# EAGLE design CC2640_interface (EAGLE 7.6.0)

## Sheet 1 of 4
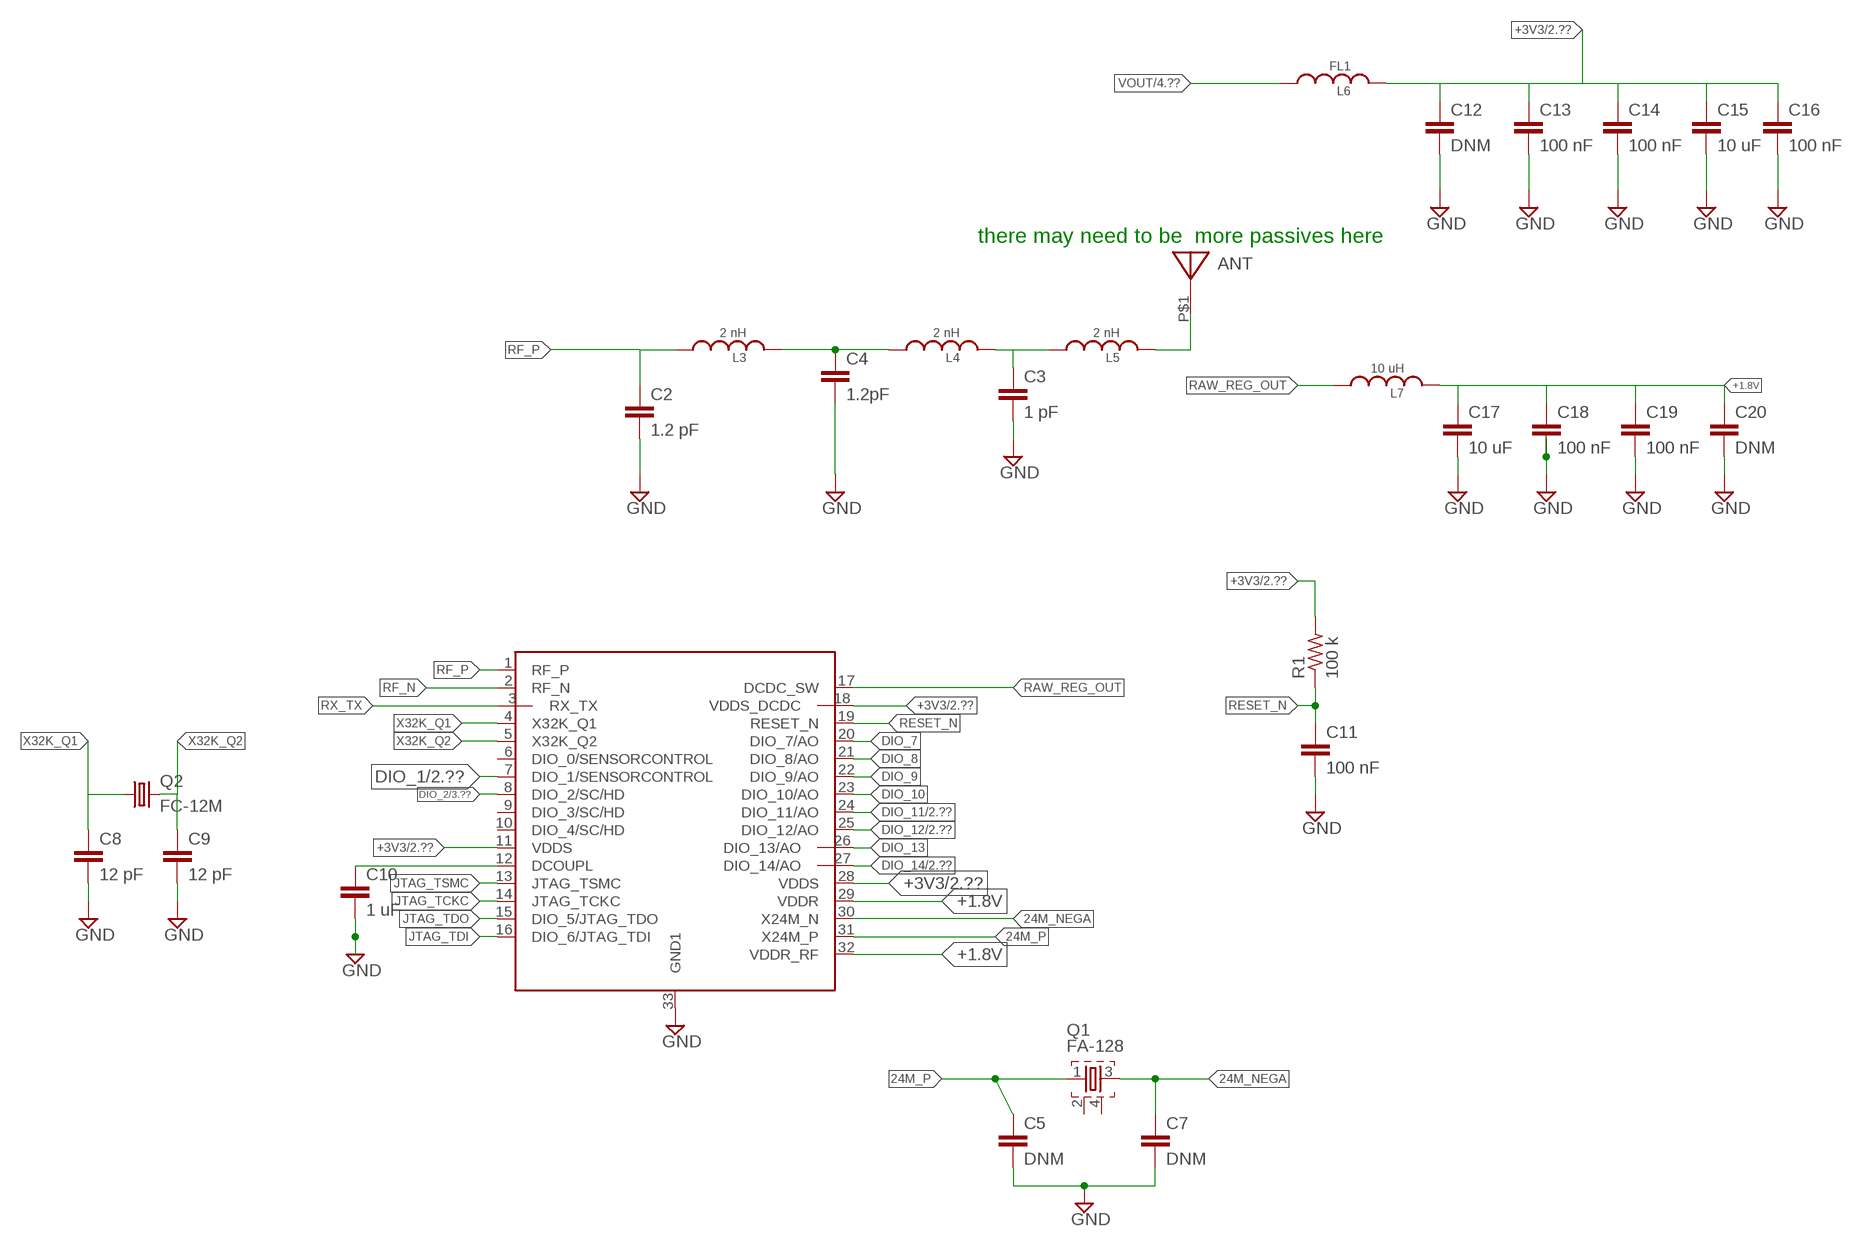
[diagram p0: schematic, sheet 1]

### Parts
ANT  2450AT18A100  [2450AT18A100]
C2  1.2 pF  C-EUC0402  [C0402]
C3  1 pF  C-EUC0402  [C0402]
C4  1.2pF  C-EUC0402  [C0402]
C5  DNM  C-EUC0402  [C0402]
C7  DNM  C-EUC0402  [C0402]
C8  12 pF  C-EUC0402  [C0402]
C9  12 pF  C-EUC0402  [C0402]
C10  1 uF  C-EUC0402  [C0402]
C11  100 nF  C-EUC0402  [C0402]
C12  DNM  C-EUC0402  [C0402]
C13  100 nF  C-EUC0402  [C0402]
C14  100 nF  C-EUC0402  [C0402]
C15  10 uF  C-EUC0402  [C0402]
C16  100 nF  C-EUC0402  [C0402]
C17  10 uF  C-EUC0402  [C0402]
C18  100 nF  C-EUC0402  [C0402]
C19  100 nF  C-EUC0402  [C0402]
C20  DNM  C-EUC0402  [C0402]
L3  2 nH  INDUCTOR0603  [0603_CAP]
L4  2 nH  INDUCTOR0603  [0603_CAP]
L5  2 nH  INDUCTOR0603  [0603_CAP]
L6  FL1  INDUCTOR0603  [0603_CAP]
L7  10 uH  INDUCTOR0603  [0603_CAP]
Q1  FA-128  [FA-128]
Q2  FC-12M  [FC-12M]
R1  100 k  R-US_R0402  [R0402@1]
U$1  CC2640-5MM  [S-PVQFN-N32]

### Nets
24M_NEGA: C7.1 Q1.3 U$1.30(X24M_N)
24M_P: C5.1 Q1.1 U$1.31(X24M_P)
+1.8V: C17.1 C18.1 C19.1 C20.1 L7.2 U$1.29(VDDR) U$1.32(VDDR_RF)
+3V3: C12.1 C13.1 C14.1 C15.1 C16.1 L6.2 R1.2 U$1.11(VDDS) U$1.18(VDDS_DCDC) U$1.28(VDDS) ; also sheet 2,3
DCOUPLE_ME: C10.1 U$1.12(DCOUPL)
DIO_1: U$1.7(DIO_1/SENSORCONTROL) ; also sheet 2
DIO_2: U$1.8(DIO_2/SC/HD) ; also sheet 3
DIO_7: U$1.20(DIO_7/AO)
DIO_8: U$1.21(DIO_8/AO)
DIO_9: U$1.22(DIO_9/AO)
DIO_10: U$1.23(DIO_10/AO)
DIO_11: U$1.24(DIO_11/AO) ; also sheet 2,3
DIO_12: U$1.25(DIO_12/AO) ; also sheet 2,3
DIO_13: U$1.26(DIO_13/AO)
DIO_14: U$1.27(DIO_14/AO) ; also sheet 2,3
GND: C2.2 C3.2 C4.2 C5.2 C7.2 C8.2 C9.2 C10.2 C11.2 C12.2 C13.2 C14.2 C15.2 C16.2 C17.2 C18.2 C19.2 C20.2 U$1.33(GND1) ; also sheet 2,3,4
JTAG_TCKC: U$1.14(JTAG_TCKC)
JTAG_TDI: U$1.16(DIO_6/JTAG_TDI)
JTAG_TDO: U$1.15(DIO_5/JTAG_TDO)
JTAG_TSMC: U$1.13(JTAG_TSMC)
N$4: C4.1 L3.2 L4.1
N$5: C3.1 L4.2 L5.1
N$7: ANT.P$1 L5.2
RAW_REG_OUT: L7.1 U$1.17(DCDC_SW)
RESET_N: C11.1 R1.1 U$1.19(RESET_N)
RF_N: U$1.2(RF_N)
RF_P: C2.1 L3.1 U$1.1(RF_P)
RX_TX: U$1.3(RX_TX)
VOUT: L6.1 ; also sheet 4
X32K_Q1: C8.1 Q2.1 U$1.4(X32K_Q1)
X32K_Q2: C9.1 Q2.2 U$1.5(X32K_Q2)
Unconnected: Q1.2 Q1.4 U$1.6(DIO_0/SENSORCONTROL) U$1.9(DIO_3/SC/HD) U$1.10(DIO_4/SC/HD)

### Notes on the sheet
- there may need to be  more passives here

## Sheet 2 of 4
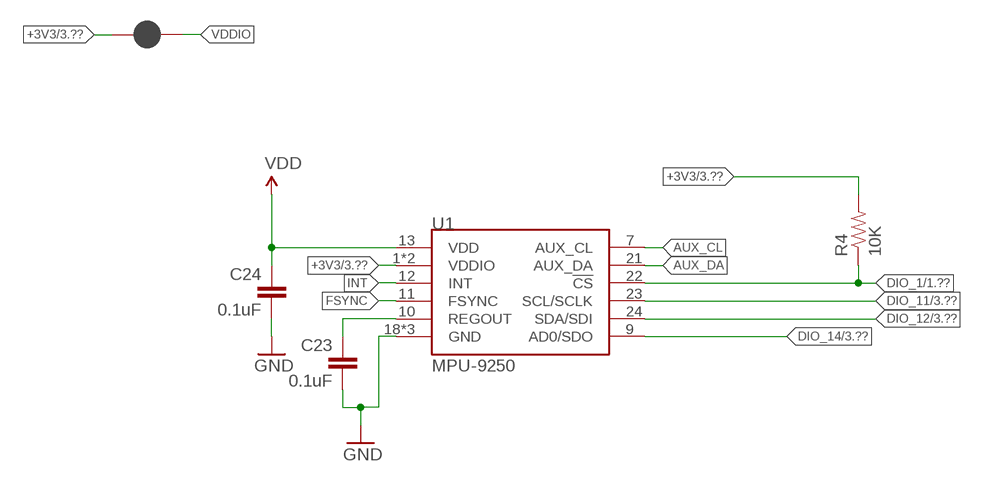
[diagram p1: schematic, sheet 2]

### Parts
C23  0.1uF  0.1UF-25V(+80/-20%)(0603)  [0603-CAP]
C24  0.1uF  0.1UF-25V(+80/-20%)(0603)  [0603-CAP]
R4  10K  10KOHM-1/10W-1%(0603)0603  [0603-RES]
SJ1  JUMPER-PAD-2-NC_BY_PASTEFULL-BOX-SILK  [PAD-JUMPER-2-NC_BY_PASTE_YES_SILK_FULL_BOX]
U1  MPU-9250  [QFN24_PAD]

### Nets
+3V3: C24.1 R4.2 SJ1.1 U1.1(VDDIO) U1.8(VDDIO) U1.13(VDD) ; supply symbol labelled VDD ; also sheet 1,3
ADSD_STUB: U1.9(AD0/SDO)
AUX_CL: U1.7(AUX_CL)
AUX_DA: U1.21(AUX_DA)
DIO_1: R4.1 U1.22(!CS) ; also sheet 1
DIO_11: U1.23(SCL/SCLK) ; also sheet 1,3
DIO_12: U1.24(SDA/SDI) ; also sheet 1,3
FSYNC: U1.11(FSYNC)
GND: C23.2 C24.2 U1.18(GND) U1.20(GND) U1.CENTER(GND) ; also sheet 1,3,4
INT: U1.12(INT)
REGOUT: C23.1 U1.10(REGOUT)
VDDIO: SJ1.2

## Sheet 3 of 4
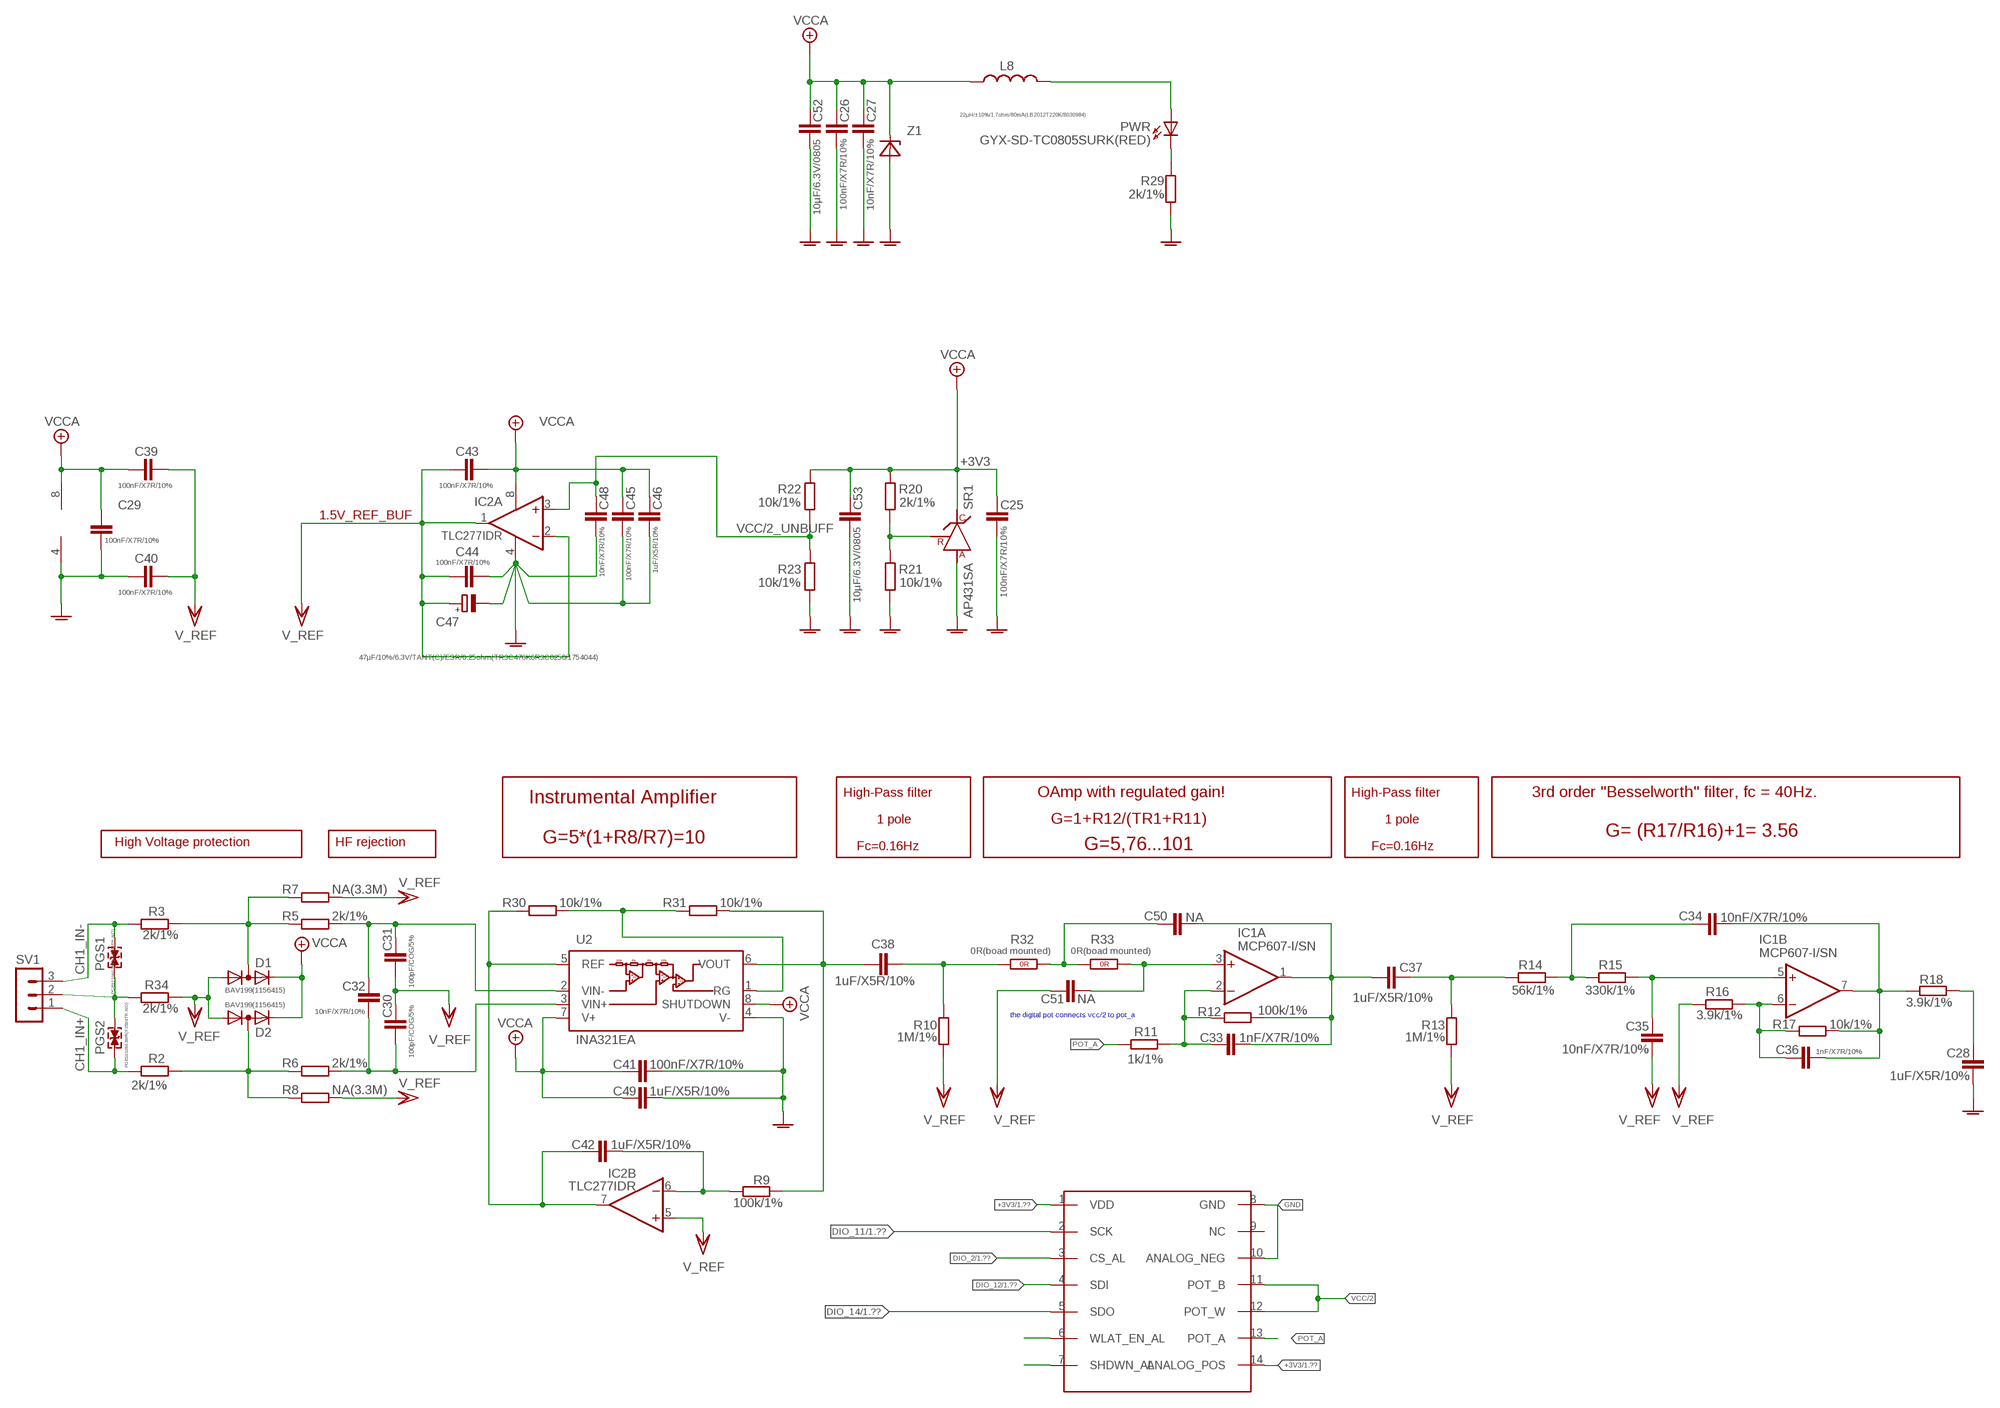
[diagram p2: schematic, sheet 3]

### Parts
C25  100nF/X7R/10%  C-EUC0603_DWS  [C0603_DWS]
C26  100nF/X7R/10%  C-EUC0603_DWS  [C0603_DWS]
C27  10nF/X7R/10%  C-EUC0603_DWS  [C0603_DWS]
C28  1uF/X5R/10%  C-EUC0603_DWS  [C0603_DWS]
C29  100nF/X7R/10%  C-EUC0603_DWS  [C0603_DWS]
C30  100pF/COG/5%  C-EUC0603_DWS  [C0603_DWS]
C31  100pF/COG/5%  C-EUC0603_DWS  [C0603_DWS]
C32  10nF/X7R/10%  C-EUC0603_DWS  [C0603_DWS]
C33  1nF/X7R/10%  C-EUC0603_DWS  [C0603_DWS]
C34  10nF/X7R/10%  C-EUC0603_DWS  [C0603_DWS]
C35  10nF/X7R/10%  C-EUC0603_DWS  [C0603_DWS]
C36  1nF/X7R/10%  C-EUC0603_DWS  [C0603_DWS]
C37  1uF/X5R/10%  C-EUC0603_DWS  [C0603_DWS]
C38  1uF/X5R/10%  C-EUC0603_DWS  [C0603_DWS]
C39  100nF/X7R/10%  C-EUC0603_DWS  [C0603_DWS]
C40  100nF/X7R/10%  C-EUC0603_DWS  [C0603_DWS]
C41  100nF/X7R/10%  C-EUC0603_DWS  [C0603_DWS]
C42  1uF/X5R/10%  C-EUC0603_DWS  [C0603_DWS]
C43  100nF/X7R/10%  C-EUC0603_DWS  [C0603_DWS]
C44  100nF/X7R/10%  C-EUC0603_DWS  [C0603_DWS]
C45  100nF/X7R/10%  C-EUC0603_DWS  [C0603_DWS]
C46  1uF/X5R/10%  C-EUC0603_DWS  [C0603_DWS]
C47  47µF/10%/6.3V/TANT(C)/ESR/0.25ohm(TR3C476K6R3C0250/1754044)  CPOL-EUCT6032  [CT6032]
C48  10nF/X7R/10%  C-EUC0603_DWS  [C0603_DWS]
C49  1uF/X5R/10%  C-EUC0603_DWS  [C0603_DWS]
C50  NA  C-EUC0603_DWS_NA  [C0603_DWS_NA]
C51  NA  C-EUC0603_DWS_NA  [C0603_DWS_NA]
C52  10µF/6.3V/0805  C-EUC0805_5MIL_DWS  [C0805_5MIL_DWS]
C53  10µF/6.3V/0805  C-EUC0805_5MIL_DWS  [C0805_5MIL_DWS]
D1  BAV199(1156415)  DIODE_AC-AC_  [SOT23C(BAT54S)]
D2  BAV199(1156415)  DIODE_AC-AC_  [SOT23C(BAT54S)]
DIG_POT  MCP41HVX1  [TSSOP-14/5MM]
IC1  MCP607-I/SN  LM358D  [SO08]
IC2  TLC277IDR  LM358D  [SO08]
L8  22µH/±10%/1.7ohm/80mA(LB2012T220K/8030984)  L-USL0805_5MIL_DWS  [L0805_5MIL_DWS]
PGS1  PGB1010603MR(F2594TR-ND)  [0603]
PGS2  PGB1010603MR(F2594TR-ND)  [0603]
PWR  GYX-SD-TC0805SURK(RED)  LED0805DWS  [LED-0805]
R2  2k/1%  R-EU_R0603_5MIL_DWS  [R0603_5MIL_DWS]
R3  2k/1%  R-EU_R0603_5MIL_DWS  [R0603_5MIL_DWS]
R5  2k/1%  R-EU_R0603_5MIL_DWS  [R0603_5MIL_DWS]
R6  2k/1%  R-EU_R0603_5MIL_DWS  [R0603_5MIL_DWS]
R7  NA(3.3M)  R-EU_R0603_5MIL_DWS_NA  [R0603_5MIL_DWS_NA]
R8  NA(3.3M)  R-EU_R0603_5MIL_DWS_NA  [R0603_5MIL_DWS_NA]
R9  100k/1%  R-EU_R0603_5MIL_DWS  [R0603_5MIL_DWS]
R10  1M/1%  R-EU_R0603_5MIL_DWS  [R0603_5MIL_DWS]
R11  1k/1%  R-EU_R0603_5MIL_DWS  [R0603_5MIL_DWS]
R12  100k/1%  R-EU_R0603_5MIL_DWS  [R0603_5MIL_DWS]
R13  1M/1%  R-EU_R0603_5MIL_DWS  [R0603_5MIL_DWS]
R14  56k/1%  R-EU_R0603_5MIL_DWS  [R0603_5MIL_DWS]
R15  330k/1%  R-EU_R0603_5MIL_DWS  [R0603_5MIL_DWS]
R16  3.9k/1%  R-EU_R0603_5MIL_DWS  [R0603_5MIL_DWS]
R17  10k/1%  R-EU_R0603_5MIL_DWS  [R0603_5MIL_DWS]
R18  3.9k/1%  R-EU_R0603_5MIL_DWS  [R0603_5MIL_DWS]
R20  2k/1%  R-EU_R0603_5MIL_DWS  [R0603_5MIL_DWS]
R21  10k/1%  R-EU_R0603_5MIL_DWS  [R0603_5MIL_DWS]
R22  10k/1%  R-EU_R0603_5MIL_DWS  [R0603_5MIL_DWS]
R23  10k/1%  R-EU_R0603_5MIL_DWS  [R0603_5MIL_DWS]
R29  2k/1%  R-EU_R0603_5MIL_DWS  [R0603_5MIL_DWS]
R30  10k/1%  R-EU_R0603_5MIL_DWS  [R0603_5MIL_DWS]
R31  10k/1%  R-EU_R0603_5MIL_DWS  [R0603_5MIL_DWS]
R32  0R(boad mounted)  R_0R0R(NA)  [0603_0R]
R33  0R(boad mounted)  R_0R0R(NA)  [0603_0R]
R34  2k/1%  R-EU_R0603_5MIL_DWS  [R0603_5MIL_DWS]
SR1  AP431SA  TL431'''  [SOT-23]
SV1  MA03-1  [MA03-1]
U2  INA321EA  [MSOP8]
Z1  BZV55C6V2  ZDIOD-SMD  [MINI-MELF]

### Nets
+3V3: C25.1 C26.1 C27.1 C29.1 C39.1 C41.1 C43.2 C45.1 C46.1 C49.1 C52.1 C53.1 D1.2(K) D2.2(K) DIG_POT.1(VDD) DIG_POT.14(ANALOG_POS) IC1.8(P:V+) IC2.8(P:V+) L8.2 R20.2 R22.2 SR1.1(C) U2.7(V+) U2.8(SHUTDOWN) Z1.1(C) ; supply symbol labelled VCCA ; also sheet 1,2
ADC0: C28.1 R18.1
CH1_IN+: PGS2.1 R2.1 SV1.1
CH1_IN-: PGS1.2 R3.1 SV1.3
DIO_2: DIG_POT.3(CS_AL) ; also sheet 1
DIO_11: DIG_POT.2(SCK) ; also sheet 1,2
DIO_12: DIG_POT.4(SDI) ; also sheet 1,2
DIO_14: DIG_POT.5(SDO) ; also sheet 1,2
GND: DIG_POT.8(GND) DIG_POT.10(ANALOG_NEG) ; also sheet 1,2,4
GNDA [pwr]: C25.2 C26.2 C27.2 C28.2 C29.2 C40.1 C41.2 C44.2 C45.2 C46.2 C47.- C48.2 C49.2 C52.2 C53.2 IC1.4(P:V-) IC2.4(P:V-) R21.1 R23.1 R29.1 SR1.3(A) U2.4(V-) Z1.2(A)
N$1: D1.3(AK) R3.2 R5.2 R7.2
N$6: DIG_POT.6(WLAT_EN_AL)
N$8: D2.3(AK) R2.2 R6.2 R8.2
N$9: C42.2 IC2.7(B:OUT) R30.2 U2.5(REF)
N$10: R30.1 R31.2 U2.1(RG)
N$11: L8.1 PWR.A
N$12: DIG_POT.7(SHDWN_AL)
N$15: PWR.C R29.2
N$22: R20.1 R21.2 SR1.2(R)
N$37: C38.2 R10.1 R32.1(1.1)
N$38: C50.1 R32.2(1.2) R33.1(1.1)
N$39: PGS1.1 PGS2.2 R34.1 SV1.2
N$81: C37.2 R13.1 R14.1
N$83: C38.1 R9.2 R31.1 U2.6(VOUT)
N$92: C30.1 C32.1 R6.1 U2.3(VIN+)
N$93: C31.2 C32.2 R5.1 U2.2(VIN-)
N$102: C51.1 IC1.3(A:+IN) R33.2(1.2)
N$104: C33.2 C37.1 C50.2 IC1.1(A:OUT) R12.2
N$105: C33.1 IC1.2(A:-IN) R11.1 R12.1
N$107: C35.1 IC1.5(B:+IN) R15.2
N$108: C34.1 R14.2 R15.1
N$109: C34.2 C36.2 IC1.7(B:OUT) R17.2 R18.2
N$110: C36.1 IC1.6(B:-IN) R16.1 R17.1
N$145: C42.1 IC2.6(B:-IN) R9.1
POT_A: DIG_POT.13(POT_A) R11.2
VCC/2: C30.2 C31.1 C35.2 C39.2 C40.2 C43.1 C44.1 C47.+ C51.2 D1.1(A) D2.1(A) DIG_POT.11(POT_B) DIG_POT.12(POT_W) IC2.1(A:OUT) IC2.2(A:-IN) IC2.5(B:+IN) R7.1 R8.1 R10.2 R13.2 R16.2 R34.2 ; supply symbol labelled V_REF
VCC/2_UNBUFF: C48.1 IC2.3(A:+IN) R22.1 R23.2
Unconnected: DIG_POT.9(NC)

### Notes on the sheet
- 1.5V_REF_BUF
- High-Pass filter | OAmp with regulated gain! | High-Pass filter | 3rd order "Besselworth" filter, fc = 40Hz.
- Instrumental Amplifier
- 1 pole | G=1+R12/(TR1+R11) | 1 pole
- High Voltage protection | HF rejection | G= (R17/R16)+1= 3.56
- G=5*(1+R8/R7)=10
- Fc=0.16Hz | G=5,76...101 | Fc=0.16Hz
- the digital pot connects vcc/2 to pot_a

## Sheet 4 of 4
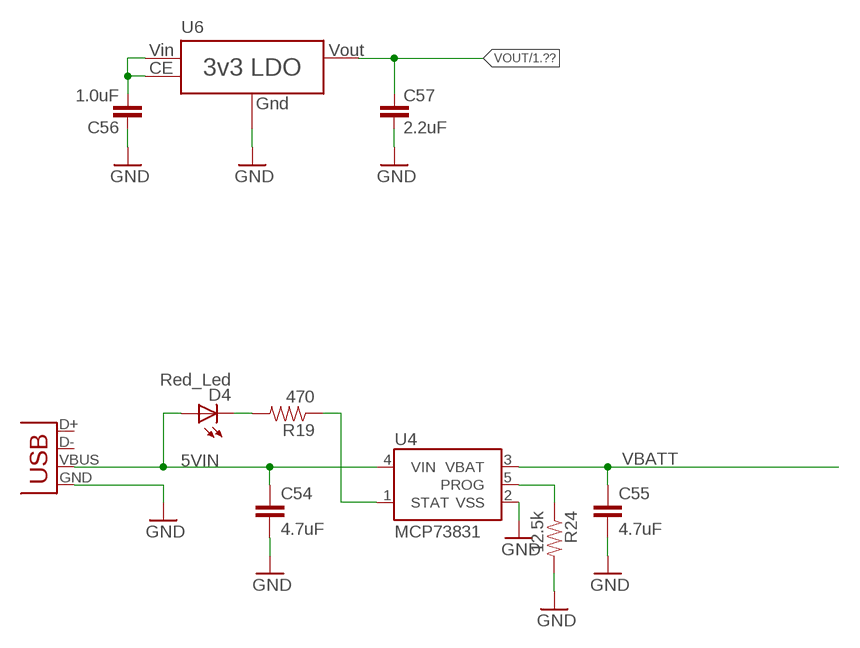
[diagram p3: schematic, sheet 4]

### Parts
C54  4.7uF  CAP0402-CAP  [0402-CAP]
C55  4.7uF  CAP0402-CAP  [0402-CAP]
C56  1.0uF  C-EUC0805  [C0805]
C57  2.2uF  C-EUC0805  [C0805]
D4  Red_Led  LED0603  [LED-0603]
R19  470  RESISTOR0402-RES  [0402-RES]
R24  12.5k  RESISTOR0402-RES  [0402-RES]
U4  MCP73831  [SOT23-5]
U6  XC6210  [SOT-25]
X1  USB-MICROB  [USB-MICROB]

### Nets
5VIN: C54.1 D4.A U4.4(VIN) X1.VBUS
GND: C54.2 C55.2 C56.1 C57.2 R24.2 U4.2(VSS) U6.2(GND) X1.GND ; also sheet 1,2,3
N$2: R24.1 U4.5(PROG)
N$3: D4.C R19.2
N$14: R19.1 U4.1(STAT)
VBATT: C55.1 C56.2 U4.3(VBAT) U6.1(VIN) U6.3(CE)
VOUT: C57.1 U6.5(VOUT) ; also sheet 1
Unconnected: X1.D+ X1.D-

## Library data of the parts
ANT = Johanson_antenna:2450AT18A100
C2-C5 C7-C20 C25-C46 C48-C53 = rcl:C-EU: CAPACITOR, European symbol
C23 C24 = SparkFun-Capacitors:0.1UF-25V(+80/-20%)(0603): CAP-00810 Ceramic Standard decoupling cap; PROD_ID: CAP-00810
C47 = rcl:CPOL-EU: POLARIZED CAPACITOR, European symbol
C54 C55 = SparkFun:CAP: Capacitor Standard 0603 ceramic capacitor, and 0.1" leaded capacitor.
C56 C57 = Jon_LIB:C-EU: CAPACITOR, European symbol
D1 D2 = semicon-smd-ipc:DIODE_AC-AC_: DUAL DIODE
D4 = SparkFun:LED: LEDs Standard schematic elements and footprints for 5mm, 3mm, 1206, and 0603 sized LEDs. 5mm - Spark Fun Electronics SKU : COM-00529 (and others)
DIG_POT = chips:MCP41HVX1
IC1 IC2 = linear:LM358: OP AMP
L3-L7 = passives:INDUCTOR: A very specific inductor
L8 = rcl:L-US: INDUCTOR, American symbol
PGS1 PGS2 = OLIMEX_DISCRET:PGB1010603MR: PulseGuard® Suppressors Surface Mount Polymeric ESD Suppressors
PWR = DOUBLE-SIDE:LED
Q1 = crystal:FA-: MHz RANGE CRYSTAL UNIT Source: Epson Toyocom
Q2 = crystal:FC-12M: kHz RANGE CRYSTAL UNIT LOW PROFILE SMD Source: Epson Toyocom FC-12M.pdf
R1 = rcl:R-US_: RESISTOR, American symbol
R2 R3 R5-R18 R20-R23 R29-R31 R34 = rcl:R-EU_: RESISTOR, European symbol
R4 = SparkFun-Resistors:10KOHM-1/10W-1%(0603): RES-00824; PROD_ID: RES-00824
R19 R24 = SparkFun:RESISTOR: Resistor Basic schematic elements and footprints for 0603, 1206, and PTH resistors.
R32 R33 = OLIMEX_DISCRET:R_0R
SJ1 = SparkFun-Passives:JUMPER-PAD-2-NC_BY_PASTE
SR1 = OLIMEX_IC:TL431: TL431 Programmable Shunt Regulator Features: -> Programmable Output Voltage to 36 Volts -> Low Dynamic Output Impedance 0.20 Typical -> Sink Current Capability of 1.0 to 100mA -> Equivalent Full-Range Temperature Coefficient of 50ppm/°C Typical -> Temperature Compensated For Operation Over Full Rated Operating Temperature Range -> Low Output Noise Voltage -> Fast Turn-on Response
SV1 = con-lstb:MA03-1: PIN HEADER; OC_FARNELL: unknown; OC_NEWARK: unknown
U1 = Testing:MPU-9250: NC pin 19. 2-6 & 14-17 not internally connected. May be used for PCB trace routing.; PROD_ID: IC-13192
U2 = OLIMEX_IC:INA321
U4 = SparkFun:MCP73831: Microchip's MCP73831 Miniature single cell, fully integrated Li-Ion, Li-polymer charge management controller http://ww1.microchip.com/downloads/en/DeviceDoc/21984a.pdf
U6 = MAAV:XC6210; DIGIKEY#: 893-1075-1-ND
U$1 = chips:CC2640-5MM
X1 = SparkFun:USB: USB Connectors USB-B-PTH is fully proven SKU : PRT-00139 USB-miniB is fully proven SKU : PRT-00587 USB-A-PCB is untested. USB-A-H is throughly reviewed, but untested. Spark Fun Electronics SKU : PRT-00437 USB-B-SMT is throughly reviewed, but untested. Needs silkscreen touching up. USB-A-S has not been used/tested USB-MB-H has not been used/tested
Z1 = gogo:ZDIOD-SMD

## Net classes
1 pwr: width 0.4 mm, drill 0.6 mm, clearance 0.23 mm

## Board
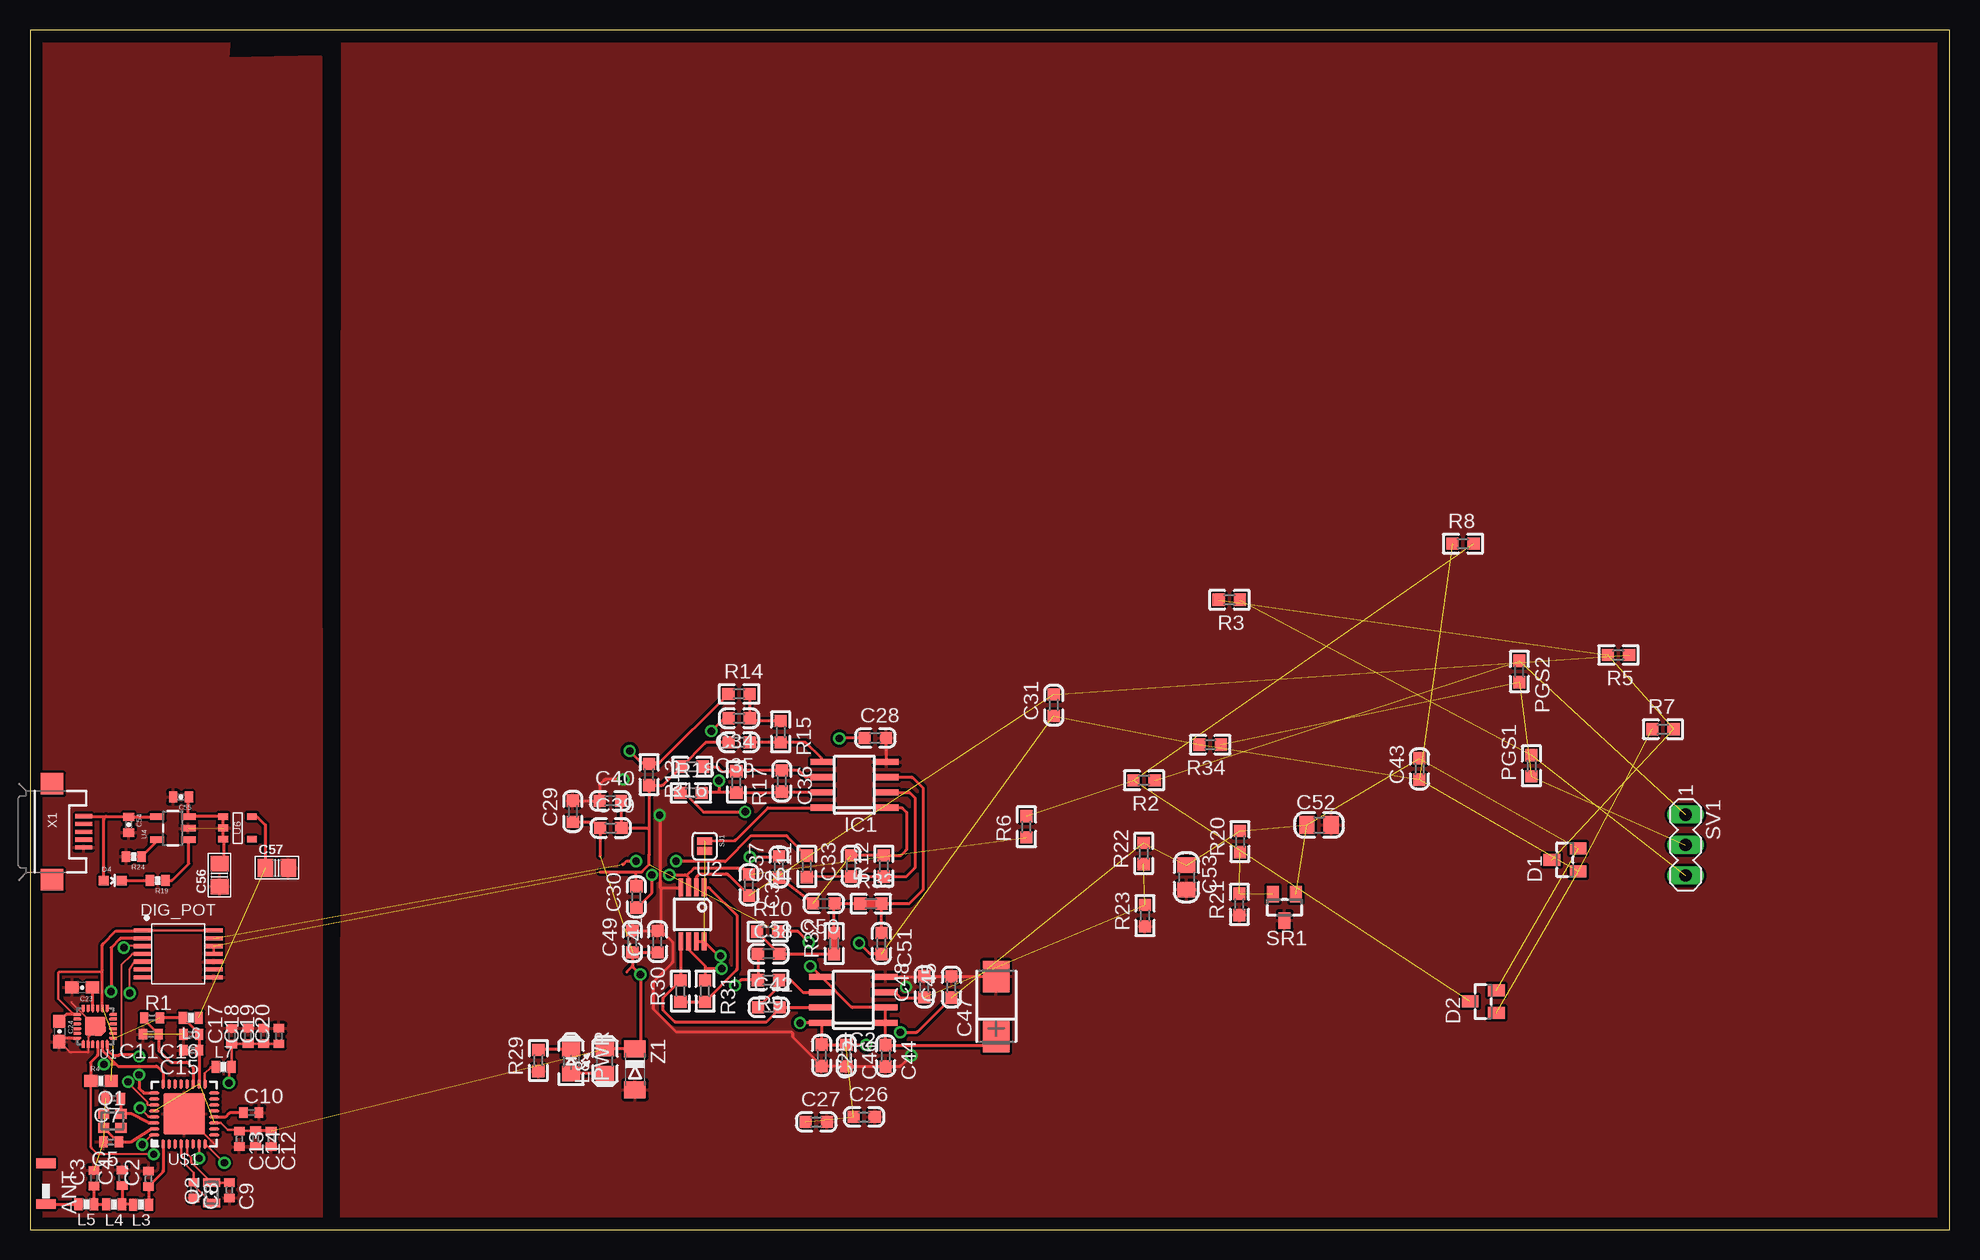
[diagram p4: board, top side]
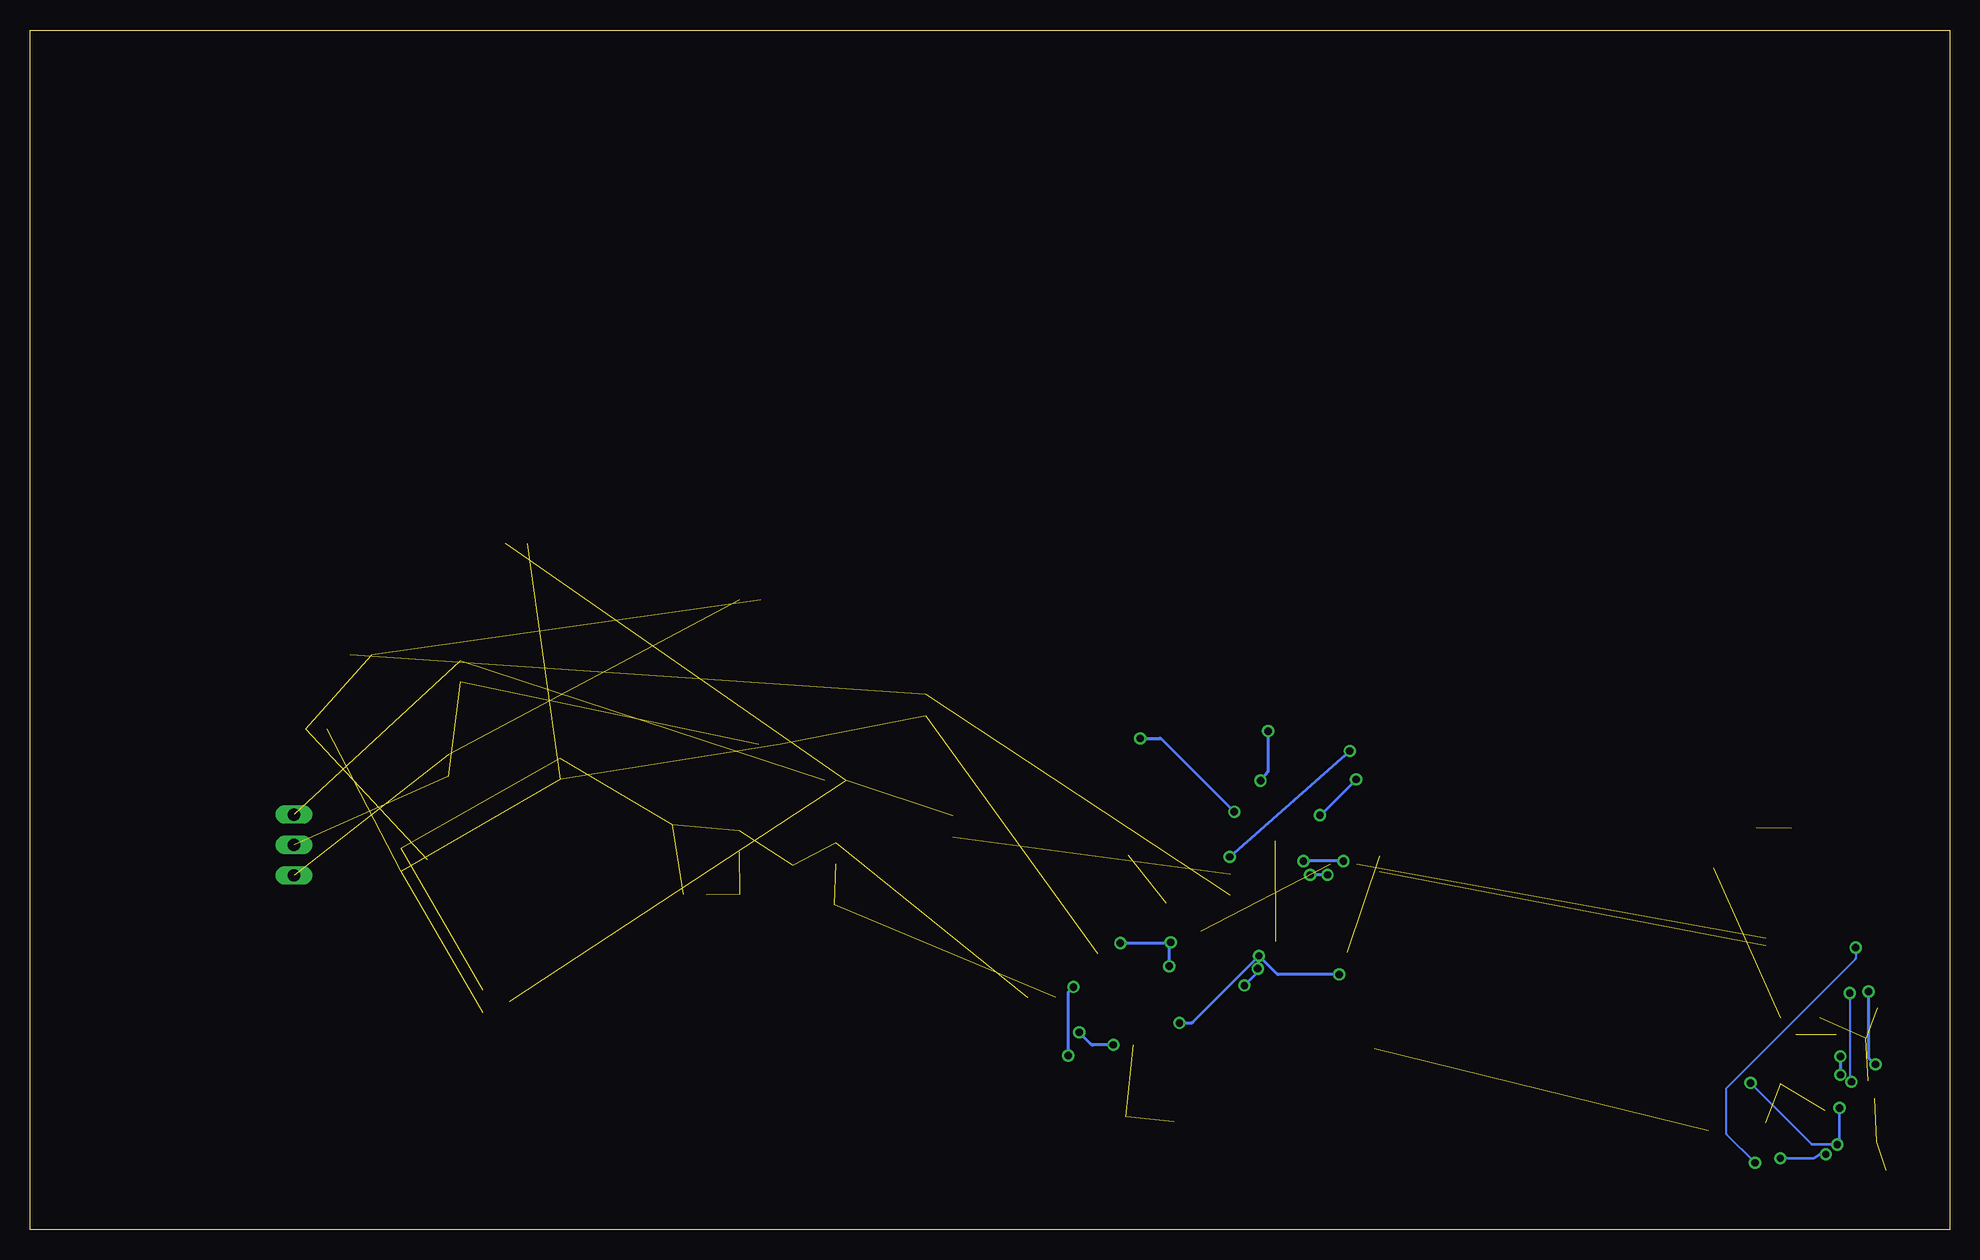
[diagram p5: board, bottom side, seen from below]

Size 160 x 100 mm. Coordinates in mm from the lower left corner, seen from the top.
Outline: 0,0 160,0 160,100 0,100 0,0
Copper layers (1*16): Top 0.035mm / dielectric 1.5mm / Bottom 0.035mm
Design rules "default": minimum track width 10mil, minimum drill 24mil, track to track 8mil, track to pad 8mil, pad to pad 8mil, via to via 8mil, smd to smd 8mil, copper to edge 40mil, drill to drill 8mil, minimum pad ring 10mil, minimum via ring 8mil, stop-mask expansion 4mil, vias tented up to drill 0mil, thermal gap 10mil

### Footprints (pad centres in the part's own frame; a part is rotated, then mirrored left to right if it is on the bottom)
2450AT18A100 = smd 0.8 x 1.6: P$1 -1.7,0; P$2 1.7,0
C0402 = smd 0.7 x 0.9: 1 -0.65,0; 2 0.65,0
0603-CAP = smd 1.1 x 1: 1 -0.85,0; 2 0.85,0
C0603_DWS = smd 1.016 x 1.016: 1 -0.889,0; 2 0.889,0
CT6032 = smd 2.6 x 2.2: + -2.5,0; - 2.5,0
C0603_DWS_NA = smd 1.016 x 1.016: 1 -0.889,0; 2 0.889,0
C0805_5MIL_DWS = smd 1.27 x 1.524: 1 -1.016,0; 2 1.016,0
0402-CAP = smd 0.7 x 0.9: 1 -0.65,0; 2 0.65,0
C0805 = smd 1.3 x 1.5: 1 -0.95,0; 2 0.95,0
SOT23C(BAT54S) = smd 1 x 1.4: 1 -0.95,-1.1; 2 0.95,-1.1; 3 0,1.1
LED-0603 = smd 0.8 x 0.8: A 0,-0.75; C 0,0.75
TSSOP-14/5MM = smd 1.5 x 0.35: 1 -2.95,1.95; 2 -2.95,1.3; 3 -2.95,0.65; 4 -2.95,0; 5 -2.95,-0.65; 6 -2.95,-1.3; 7 -2.95,-1.95; 8 2.95,-1.95; 9 2.95,-1.3; 10 2.95,-0.65; 11 2.95,0; 12 2.95,0.65; 13 2.95,1.3; 14 2.95,1.95
SO08 = smd 0.508 x 2.032: 1 -1.905,-2.667; 2 -0.635,-2.667; 3 0.635,-2.667; 4 1.905,-2.667; 5 1.905,2.667; 6 0.635,2.667; 7 -0.635,2.667; 8 -1.905,2.667
0603_CAP = smd 0.7 x 1: 1 -0.65,0; 2 0.65,0
L0805_5MIL_DWS = smd 1.27 x 1.524: 1 -1.016,0; 2 1.016,0
0603 = smd 1.016 x 1.016: 1 -0.889,0; 2 0.889,0
LED-0805 = smd 1.27 x 1.524: A 1.016,0; C -1.016,0
FA-128 = smd 0.95 x 0.85: 1 -0.725,-0.575; 2 0.725,-0.575; 3 0.725,0.575; 4 -0.725,0.575
FC-12M = smd 0.7 x 1.4: 1 -0.85,0; 2 0.85,0
R0402@1 = smd 0.7 x 0.9: 1 -0.65,0; 2 0.65,0
R0603_5MIL_DWS = smd 1.016 x 1.016: 1 -0.889,0; 2 0.889,0
0603-RES = smd 1.1 x 1: 1 -0.85,0; 2 0.85,0
R0603_5MIL_DWS_NA = smd 1.016 x 1.016: 1 -0.889,0; 2 0.889,0
0402-RES = smd 0.7 x 0.9: 1 -0.65,0; 2 0.65,0
0603_0R = smd 1.016 x 1.016: 1 -0.889,0; 2 0.889,0
PAD-JUMPER-2-NC_BY_PASTE_YES_SILK_FULL_BOX = smd 0.635 x 1.27: 1 -0.412,0; 2 0.412,0
SOT-23 = smd 1 x 1.4: 1 -0.95,-1.1; 2 0.95,-1.1; 3 0,1.1
MA03-1 = drill 1.016 long: 1 -2.54,0; 2 0,0; 3 2.54,0
QFN24_PAD = smd 0.5 x 0.25: 1 -1.55,1; 2 -1.55,0.6; 3 -1.55,0.2; 4 -1.55,-0.2; 5 -1.55,-0.6; 6 -1.55,-1; 13 1.55,-1; 14 1.55,-0.6; 15 1.55,-0.2; 16 1.55,0.2; 17 1.55,0.6; 18 1.55,1 | smd 0.08 x 0.13: 1$1 -1.32,1.06; 1$3 -1.26,0.94; P$33 1.26,-0.94; P$34 1.32,-1.06; P$58 1.26,0.94; P$59 1.32,1.06; P$68 -1.26,-0.94; P$69 -1.32,-1.06 | smd 0.1 x 0.185 rotated 45: 1$2 -1.25,1.024; P$49 1.024,-1.25 | smd 0.14 x 0.14: 1$4 -1.22,0.945; P$23 -0.945,-1.22; P$24 1.22,-0.945; P$36 0.945,1.22; P$51 0.945,-1.22; P$56 1.22,0.945; P$61 -0.945,1.22; P$66 -1.22,-0.945 | smd 0.05 x 0.05: 1$5 -1.175,0.97; P$25 -0.97,-1.175; P$31 1.175,-0.97; P$37 0.97,1.175; P$52 0.97,-1.175; P$57 1.175,0.97; P$62 -0.97,1.175; P$67 -1.175,-0.97 | smd 0.25 x 0.5: 7 -1,-1.55; 8 -0.6,-1.55; 9 -0.2,-1.55; 10 0.2,-1.55; 11 0.6,-1.55; 12 1,-1.55; 19 1,1.55; 20 0.6,1.55; 21 0.2,1.55; 22 -0.2,1.55; 23 -0.6,1.55; 24 -1,1.55 | smd 0.25 x 0.25: CENTER 0,0 | smd 0.4 x 0.4: DBBADFE -0.675,0.24 | smd 0.6 x 1.2: DBBADFE1 -0.575,-0.195 | smd 0.25 x 0.3: P$1 -0.2,1.3; P$3 0.2,1.3; P$5 0.6,1.3; P$11 -0.6,1.3; P$16 0.2,-1.3; P$18 -0.2,-1.3; P$20 -0.6,-1.3; P$26 0.6,-1.3 | smd 0.3 x 0.25: P$2 -1.3,0.2; P$4 -1.3,0.6; P$28 -1.3,-0.2; P$38 -1.3,-0.6; P$40 1.3,0.2; P$42 1.3,-0.2; P$44 1.3,-0.6; P$50 1.3,0.6 | smd 0.1 x 0.185 rotated 225: P$7 1.25,-1.024; P$60 -1.024,1.25 | smd 1.1 x 1.59: P$13 0.325,0 | smd 0.3 x 0.5 rotated 315: P$14 -0.592,0.512 | smd 0.5 x 1.59: P$15 -0.27,0 | smd 0.1 x 0.185 rotated 135: P$22 -1.024,-1.25; P$55 1.25,1.024 | smd 0.13 x 0.08: P$27 -0.94,-1.26; P$29 -1.06,-1.32; P$39 0.94,1.26; P$41 1.06,1.32; P$53 0.94,-1.26; P$54 1.06,-1.32; P$63 -0.94,1.26; P$64 -1.06,1.32 | smd 0.1 x 0.185 rotated 315: P$35 1.024,1.25; P$65 -1.25,-1.024
MSOP8 = smd 0.4 x 1.5: 1 -0.975,-2.25; 2 -0.325,-2.25; 3 0.325,-2.25; 4 0.975,-2.25; 5 0.975,2.25; 6 0.325,2.25; 7 -0.325,2.25; 8 -0.975,2.25
SOT23-5 = smd 0.55 x 1.2: 1 -0.95,-1.3; 2 0,-1.3; 3 0.95,-1.3; 4 0.95,1.3; 5 -0.95,1.3
SOT-25 = smd 0.55 x 0.8: 1 -0.95,-1.2; 2 0,-1.2; 3 0.95,-1.2; 4 0.95,1.2; 5 -0.95,1.2
S-PVQFN-N32 = smd 0.26 x 0.85: 1 -0.48,-2.5; 2 0.02,-2.5; 3 0.52,-2.5; 4 1.02,-2.5; 5 1.52,-2.5; 6 2.02,-2.5; 7 2.52,-2.5; 8 3.02,-2.5; 17 3.02,2.5; 18 2.52,2.5; 19 2.02,2.5; 20 1.52,2.5; 21 1.02,2.5; 22 0.52,2.5; 23 0.02,2.5; 24 -0.48,2.5 | smd 0.85 x 0.26: 9 3.77,-1.75; 10 3.77,-1.25; 11 3.77,-0.75; 12 3.77,-0.25; 13 3.77,0.25; 14 3.77,0.75; 15 3.77,1.25; 16 3.77,1.75; 25 -1.23,1.75; 26 -1.23,1.25; 27 -1.23,0.75; 28 -1.23,0.25; 29 -1.23,-0.25; 30 -1.23,-0.75; 31 -1.23,-1.25; 32 -1.23,-1.75 | smd 3.45 x 3.45: 33 1.27,0
USB-MICROB = smd 0.35 x 1.4: D+ 0,2.65; D- -0.65,2.65; GND 1.3,2.65; ID 0.65,2.65; VBUS -1.3,2.65 | smd 1.8 x 1.9: MT1 -4,0; MT2 4,0
MINI-MELF = smd 1.4 x 1.8: 1 -1.7,0; 2 1.7,0

### Placement (x,y rotation side)
ANT  1.33,3.82 90 top
C2  9.88,4.24 90 top
C3  5.33,4.28 90 top
C4  7.68,4.32 90 top
C5  6.76,7.3 180 top
C7  6.94,10.94 180 top
C8  13.66,3.29 270 top
C9  16.63,3.28 270 top
C10  18.45,9.75 0 top
C11  10.08,16.28 180 top
C12  20.11,7.56 270 top
C13  17.45,7.56 270 top
C14  18.81,7.59 270 top
C15  13.45,14.95 180 top
C16  13.45,16.27 180 top
C17  16.82,16.11 90 top
C18  18.18,16.13 90 top
C19  19.49,16.14 90 top
C20  20.75,16.13 90 top
C23  4.35,20.17 180 top
C24  2.45,16.51 270 top
C25  65.99,14.52 270 top
C26  69.53,9.39 0 top
C27  65.54,8.97 0 top
C28  70.46,40.98 0 top
C29  45.24,34.86 90 top
C30  50.54,27.73 90 top
C31  85.33,43.71 90 top
C32  59.93,28.73 270 top
C33  68.44,30.3 90 top
C34  59.11,42.62 180 top
C35  59.11,40.61 180 top
C36  62.66,37.39 270 top
C37  62.43,30.23 90 top
C38  61.56,22.98 0 top
C39  48.4,33.47 0 top
C40  48.38,35.73 0 top
C41  52.31,24 90 top
C42  61.58,18.53 0 top
C43  115.82,38.4 90 top
C44  71.32,14.48 270 top
C45  76.81,20.22 90 top
C46  68.04,14.5 270 top
C47  80.53,18.59 90 top
C48  74.54,20.23 90 top
C49  50.21,24 90 top
C50  66.17,27.18 180 top
C51  70.97,23.85 270 top
C52  107.45,33.73 0 top
C53  96.39,29.36 270 top
C54  8.23,33.75 270 top
C55  12.59,36.05 180 top
C56  15.8,29.54 90 top
C57  20.58,30.15 0 top
D1  127.95,30.82 90 top
D2  121.14,19 90 top
D4  6.9,29.1 270 top
DIG_POT  12.34,22.98 0 top
IC1  68.73,37.08 90 top
IC2  68.64,19.14 90 top
L3  9.25,2.08 180 top
L4  7,2.08 180 top
L5  4.69,2.12 180 top
L6  13.41,17.66 180 top
L7  16.14,13.55 0 top
L8  47.92,14.04 90 top
PGS1  125.16,38.66 90 top
PGS2  124.14,46.52 270 top
PWR  45.1,14.01 270 top
Q1  6.87,9.06 0 top
Q2  15.14,3.06 90 top
R1  10.17,17.65 0 top
R2  92.86,37.45 180 top
R3  99.98,52.5 180 top
R4  5.93,12.41 0 top
R5  132.41,47.89 180 top
R6  83.05,33.57 90 top
R7  136.12,41.71 0 top
R8  119.45,57.18 0 top
R9  61.55,20.8 180 top
R10  61.49,24.84 0 top
R11  64.74,30.27 90 top
R12  71.17,30.3 90 top
R13  51.6,37.93 270 top
R14  59.1,44.65 0 top
R15  62.57,41.49 270 top
R16  55.19,38.58 180 top
R17  58.88,37.31 270 top
R18  55.09,36.4 0 top
R19  10.65,29.1 180 top
R20  100.86,32.35 90 top
R21  100.81,27.11 90 top
R22  92.83,31.35 90 top
R23  92.94,26.16 90 top
R24  8.66,31.09 180 top
R29  42.38,14.09 90 top
R30  54.21,19.87 90 top
R31  56.27,19.88 270 top
R32  67.03,23.84 90 top
R33  70.09,27.17 0 top
R34  98.38,40.42 180 top
SJ1  56.23,31.97 270 top
SR1  104.57,26.86 180 top
SV1  138,32.05 270 top
U1  5.44,16.95 180 top
U2  55.22,26.27 180 top
U4  11.91,33.46 90 top
U6  17.3,33.48 270 top
U$1  11.58,9.63 0 top
X1  1.84,33.16 270 top
Z1  50.43,13.35 270 top

### Tracks (layer width: path | path; a pad name or v marks a point on that pad's centre or on a via)
5VIN
  Top 0.254: X1.VBUS 6.33,34.46 | 6.33,34.46 8.08,34.46 arc-45 C54.1 10.58,34.4 arc45 U4.4 | D4.A 6.15,34.18 arc-45 6.22,34.36 6.33,34.46
24M_NEGA
  Top 0.254: U$1.30 9.95,8.88 arc-45 9.81,8.94 8.43,9.65 7.63,9.65 arc45 Q1.3 7.59,10.93 arc45 C7.1
24M_P
  Top 0.254: U$1.31 10.16,8.38 arc45 10.02,8.32 8.38,7.29 7.43,7.29 arc-45 C5.1 arc-45 7.28,7.36 Q1.1
+1.8V  (via drill 0.61)
  Top 0.203: C20.1 19.51,15.48 arc-45 C19.1 18.2,15.49 arc45 C18.1 16.87,15.48 arc45 C17.1 16.82,13.62 arc-45 L7.2 16.65,13.41 arc45 16.59,13.26 v16.59,12.22 | U$1.32 10.22,7.88 arc45 10.08,7.82 v9.35,7.09 | U$1.29 10.01,9.38 arc-45 9.87,9.44 v9.17,10.13
  Bottom 0.203: v16.59,12.22 11.52,7.15 arc-45 11.37,7.09 v9.35,7.09 9.23,7.21 arc-45 9.17,7.35 v9.17,10.13
+3V3  (via drill 0.61)  (18 unrouted)
  Top 0.152: U1.13 3.97,17.95 arc45 3.99,17.96
  Top 0.203: U$1.11 15.89,8.88 16.46,8.31 17.36,8.31 C13.1 18.79,8.21 C14.1 | 14.1,12.14 arc45 U$1.18 | 3.99,17.96 3.69,17.96 arc-45 3.55,18.02 2.34,19.23 2.34,21.28 arc-45 2.4,21.42 2.44,21.46 5.8,21.46 arc45 5.94,21.52 6.04,21.61 | DIG_POT.1 DIG_POT.14
  Top 0.254: U$1.18 C15.1 C16.1 arc-45 14.08,16.28 arc45 14.04,16.37 L6.2 10.84,17.66 arc45 R1.2 | C12.1 18.87,8.21 arc-45 C14.1 | 47.51,31.14 C39.1 47.08,33.91 arc45 46.93,33.97 C29.1 | U2.7 U2.8 57.34,22.87 arc45 57.49,22.81 v57.56,22.81 | SJ1.1 58.71,32.43 arc45 58.86,32.49 61.52,35.15 66.02,35.15 arc45 IC1.8 | v69.7,15.39 arc-45 v69.69,15.39 C46.1 arc45 67.99,15.41 C25.1 arc-45 65.97,15.46 IC2.8 64.22,17.24 arc45 v64.19,17.22 | v72.54,16.43 73.83,16.43 arc45 73.97,16.49 C45.1 | C41.1 arc-45 C41.1 C49.1 50.21,22.01 | 50.21,22.01 arc45 50.27,21.87 v50.88,21.26 50.88,15.58 arc-45 50.82,15.44 Z1.1 L8.2 arc-45 L8.2 | 50.21,22.01 arc-45 50.16,21.89 49.73,21.46 | C24.1 2.39,17.36 arc-45 2.31,17.4 2.26,17.35 | 2.41,17.35 arc45 C24.1 | U1.13 3.12,17.95 arc45 2.97,17.89 C24.1 | U1.8 6.04,21.61 6.04,23.68 arc-45 6.1,23.83 7.16,24.89 9.3,24.89 arc45 DIG_POT.1
  Bottom 0.254: v50.88,21.26 55.92,21.26 arc45 56.07,21.32 v57.56,22.81 63.09,17.28 arc45 63.23,17.22 v64.19,17.22 | v69.7,15.39 71.42,15.39 arc45 71.56,15.45 v72.54,16.43
ADC0  (via drill 0.61)
  Top 0.254: C28.1 67.55,40.98 arc45 v67.46,40.95 | v59.61,34.82 arc-45 59.55,34.8 56.13,34.8 54.59,36.34 arc45 54.45,36.4 R18.1
  Bottom 0.254: v67.46,40.95 65.82,40.95 arc45 65.68,40.88 v59.61,34.82
CH1_IN+  (2 unrouted)
CH1_IN-  (2 unrouted)
DCOUPLE_ME
  Top 0.203: 15.37,9.37 arc-45 U$1.12
  Top 0.254: C10.1 16.77,9.75 arc45 16.62,9.69 16.31,9.37 15.37,9.37 arc-45 U$1.12
DIO_1  (via drill 0.61)
  Top 0.203: R4.1 5.08,6.92 arc45 5.14,6.78 5.59,6.33 v10.31,6.27 | v14.1,5.94 14.1,7.11 arc-45 U$1.7
  Top 0.254: U1.22 5.64,14.59 arc-45 5.58,14.44 5.05,13.92 5.05,12.47 arc45 R4.1
  Bottom 0.203: v10.31,6.27 10.71,6.27 arc-45 10.86,6.21 11.3,5.94 14.04,5.94 arc-45 v14.1,5.94
DIO_2  (via drill 0.61)
  Top 0.152: DIG_POT.3 8.04,23.63 arc45 7.9,23.57 v7.82,23.5 | v16.2,5.56 arc-45 16.14,5.59 U$1.8
  Bottom 0.152: v7.82,23.5 7.82,22.64 arc45 7.88,22.5 18.64,11.73 18.64,8.09 arc-45 18.58,7.94 v16.2,5.56
DIO_11  (via drill 0.61)
  Top 0.254: U1.23 6.04,15 arc45 6.1,14.86 7.15,13.8 | 7.15,13.8 7.34,13.61 10.48,13.61 arc-45 10.63,13.55 11.1,13.08 U$1.24 arc45 U$1.24 | DIG_POT.2 7.63,24.28 arc45 7.48,24.22 6.76,23.5 v6.76,19.84 | v6.17,13.77 7.12,13.79 arc45 7.15,13.8
  Bottom 0.254: v6.76,19.84 6.76,14.38 arc-45 6.7,14.24 v6.17,13.77
DIO_12  (via drill 0.61)
  Top 0.152: 9.37,22.97 8.61,22.97 arc45 8.46,22.91 7.62,22.07 7.62,14.65 arc45 7.64,14.59
  Top 0.254: U1.24 6.44,15.06 arc45 6.5,14.92 6.88,14.53 7.36,14.53 arc45 7.5,14.59 7.64,14.59 8.85,14.59 arc-45 8.99,14.53 v9.09,14.43 | 9.37,22.97 arc45 DIG_POT.4 | v9.09,12.9 9.09,11.84 arc45 9.15,11.7 9.47,11.38 U$1.25 | U$1.25 arc45 U$1.25
  Bottom 0.254: v9.09,14.43 v9.09,12.9
DIO_14  (via drill 0.61)
  Top 0.152: DIG_POT.5 8.8,22.33 arc45 8.66,22.27 8.28,21.69 8.28,19.77 arc-45 v8.31,19.71 | v8.18,12.32 arc45 8.15,12.25 9.75,10.64 9.75,10.51 arc45 9.8,10.39 10.33,10.39 arc-45 U$1.27
  Bottom 0.152: v8.31,19.71 8.31,12.53 arc-45 8.25,12.39 v8.18,12.32
GND  (4 unrouted)
  Top 0.152: U$1.33 15.6,6.89 15.6,6.88 | 3.45,18.95 5.41,16.99 arc-45 U1.CENTER arc45 U1.CENTER 5.44,16.7 arc-45 5.38,16.55 4.85,16.03 4.85,15.43 arc-45 U1.20 4.84,14.79 arc45 4.85,14.76 3.44,14.76 arc-45 3.3,14.82 C24.2
  Top 0.254: U1.18 2.82,15.95 arc45 2.67,15.89 C24.2
  pour Top: 0.3,100.05 0,100.05 0,-0.15 24.26,-0.3 24.33,1.13 24.33,2.52 24.25,97.76 16.5,97.61 16.68,100.04
GNDA  (via drill 0.61)
  Top 0.254: C29.2 47.46,35.74 arc-45 C40.1 | C40.1 47.49,35.77 arc45 47.45,35.87 | C28.2 71.35,39.09 arc45 IC1.4 | 52.55,28.5 54.2,28.5 arc45 U2.4 | 52.55,28.5 52.55,34.38 arc45 52.49,34.53 v52.48,34.54 | v49.45,37.52 47.99,37.52 arc45 47.84,37.46 47.47,37.08 47.47,35.77 arc45 C40.1 | 71.27,13.61 arc-45 C44.2 arc45 71.27,13.61 | 76.78,21.09 arc45 C45.2 | C45.2 74.55,21.11 arc-90 C48.2 74.53,21.11 arc-45 74.39,21.05 73.03,21.05 | C45.2 arc90 76.83,21.09 C47.- | 71.27,13.61 C46.2 arc45 67.99,13.63 C25.2 63.62,16 arc-45 63.56,16.14 63.56,16.4 arc45 63.42,16.46 53.87,16.46 52,18.33 arc-45 51.94,18.47 51.94,20.62 53.48,22.16 arc45 53.54,22.31 53.54,23.98 52.69,24.83 arc45 52.55,24.89 C41.2 | IC2.4 73.03,21.05 | 71.27,13.61 72.48,13.61 arc45 72.63,13.67 v73.46,14.5 | v73.03,20.22 73.03,21.05 | 52.55,28.5 52.55,25.22 arc-45 52.49,25.08 C41.2 | C49.2 C41.2 arc45 C41.2
  Bottom 0.254: v52.48,34.54 arc-45 52.39,34.58 v49.45,37.52 | v73.46,14.5 73.46,19.7 arc45 73.4,19.85 v73.03,20.22
  pour Top (rank 2): 25.93,-0.91 159.66,-0.53 arc90 159.87,-0.33 159.87,-0.18 160.2,-0.18 arc90 160.4,0.03 160.4,98.7 arc45 160.34,98.84 159.26,99.92 37.17,99.92 arc45 26.03,100.25
N$1  (3 unrouted)
N$2
  Top 0.254: U4.5 10.61,32.49 arc-45 10.53,32.31 R24.1
N$3
  Top 0.254: D4.C R19.2
N$4
  Top 0.254: C4.1 7.68,2.14 | 7.68,2.14 arc-45 L4.1 | 7.68,2.14 8.46,2.14 arc-45 L3.2
N$5
  Top 0.254: C3.1 5.33,2.17 arc45 L5.1 6.27,2.12 arc-45 L4.2
N$7
  Top 0.254: ANT.P$1 L5.2 arc-45 L5.2
N$8  (3 unrouted)
N$9
  Top 0.254: U2.5 54.24,20.84 arc-45 R30.2 52.84,19.39 arc45 52.78,19.25 52.78,18.29 53.74,17.33 arc45 53.88,17.27 61.37,17.27 62.41,18.32 arc45 62.47,18.46 C42.2 65.92,18.53 arc-45 IC2.7
N$10
  Top 0.254: R30.1 56.26,18.99 arc45 R31.2 58.87,21.59 arc45 58.93,21.74 58.93,26.19 56.66,28.46 arc45 56.52,28.52 U2.1
N$11
  Top 0.254: L8.1 45.18,13.02 arc45 PWR.A
N$14
  Top 0.254: R19.1 11.75,29.1 arc45 11.93,29.17 13.23,30.48 13.23,32.45 arc45 U4.1
N$15
  Top 0.254: PWR.C 42.48,15.02 arc45 R29.2
N$22  (2 unrouted)
N$37
  Top 0.254: R32.1 arc45 66.97,22.98 C38.2 60.61,24.82 arc-45 R10.1
N$38
  Top 0.254: R33.1 67.1,27.17 arc-45 C50.1 arc45 67.03,27.12 R32.2
N$39  (3 unrouted)
N$81  (via drill 0.61)
  Top 0.254: R13.1 52.3,38.82 arc45 52.44,38.88 | 52.44,38.88 R14.1 | 52.44,38.88 51.1,38.88 arc-45 50.95,38.94 v49.99,39.9 | v59.99,31.06 62.31,31.06 arc45 C37.2
  Bottom 0.254: v49.99,39.9 arc45 50.01,39.86 v59.99,31.06
N$83  (via drill 0.61)
  Top 0.254: U2.6 54.9,23.45 arc45 54.95,23.3 56.29,21.97 56.29,21.72 | 56.29,21.72 56.29,20.82 arc-45 R31.1 | v58.78,20.34 59.17,20.74 arc-45 59.31,20.8 R9.2 arc45 60.67,20.81 C38.1 | v57.66,21.74 56.35,21.74 arc45 56.29,21.72
  Bottom 0.254: v58.78,20.34 57.66,21.46 v57.66,21.74
N$92  (via drill 0.61)  (1 unrouted)
  Top 0.254: C30.1 arc45 50.67,26.89 51.84,28.07 v51.84,29.57 | v53.29,29.57 54.6,29.57 arc-45 54.75,29.51 | 54.75,29.51 54.91,29.34 54.91,28.57 arc-45 U2.3 | 54.75,29.51 55.3,30.07 arc-45 55.45,30.12 59.34,30.12 arc-45 59.48,30.07 C32.1
  Bottom 0.254: v51.84,29.57 v53.29,29.57
N$93  (2 unrouted)
  Top 0.254: U2.2 55.55,29.3 arc-45 55.6,29.44 55.75,29.64 57.96,29.64 arc45 58,29.66 arc-45 58.3,29.47 C32.2
N$102
  Top 0.254: C51.1 70.97,27.14 arc-45 R33.2 arc45 71.01,27.15 73.28,27.15 74.39,28.26 arc45 74.45,28.41 74.45,36.8 73.6,37.65 arc45 73.46,37.71 IC1.3
N$104  (1 unrouted)
  Top 0.254: C33.2 arc45 68.87,31.19 R12.2 arc45 71.23,31.17 72.57,31.17 73.02,31.61 arc45 73.08,31.76 73.08,34.77 72.74,35.11 arc45 72.59,35.17 IC1.1 | C37.1 65.27,27.18 arc45 C50.2
N$105
  Top 0.254: R11.1 arc-45 64.87,29.43 C33.1 arc45 68.87,29.41 R12.1 73.03,29.41 73.73,30.12 arc45 73.79,30.26 73.79,35.97 73.37,36.38 arc45 73.23,36.44 IC1.2
N$107
  Top 0.254: IC1.5 66.06,39.11 arc45 66,39.26 64.64,40.62 62.59,40.62 arc45 R15.2 60.02,40.6 arc-45 C35.1
N$108
  Top 0.254: R15.1 60.32,42.38 arc-45 60.17,42.44 C34.1 arc-45 59.99,42.64 R14.2
N$109  (via drill 0.61)
  Top 0.254: IC1.7 62.81,36.44 arc-45 C36.2 | C36.2 | C36.2 62.65,36.48 arc-45 62.5,36.42 R17.2 arc45 58.82,36.45 57.51,36.45 | C34.2 57.95,42.62 arc45 57.8,42.56 v56.79,41.55 | 57.51,36.45 56.1,36.45 arc45 R18.2 | v57.43,37.41 57.43,36.61 arc45 57.49,36.47 57.51,36.45
  Bottom 0.254: v56.79,41.55 56.79,38.26 arc45 56.85,38.12 v57.43,37.41
N$110
  Top 0.254: IC1.6 64.71,37.71 arc-45 64.57,37.77 64.08,38.25 62.72,38.25 arc-45 C36.1 59.04,38.28 arc45 58.89,38.22 R17.1 | 58.82,38.18 arc45 R17.1 | R16.1 57.22,38.58 arc-45 57.36,38.52 57.68,38.2 R17.1
N$145
  Top 0.254: IC2.6 arc-45 65.94,19.77 64.45,19.77 63.48,20.74 arc45 63.33,20.8 R9.1 62.44,20.36 arc-45 62.38,20.22 C42.1
POT_A  (via drill 0.61)  (1 unrouted)
  Top 0.254: 49.39,30.45 arc45 49.54,30.51 49.73,30.71 v50.52,30.71 | R11.2 63.12,32.78 arc45 62.98,32.84 60.12,32.84 57.96,30.68 arc45 57.9,30.71 v53.85,30.71
  Bottom 0.254: v50.52,30.71 v53.85,30.71
RAW_REG_OUT
  Top 0.203: L7.1 15.21,13.55 arc45 15.07,13.49 14.58,13.01 14.58,12.19 arc45 U$1.17
REGOUT
  Top 0.254: U1.10 5.24,20.08 arc45 C23.1
RESET_N
  Top 0.254: R1.1 9.52,17.58 arc45 9.58,17.43 C11.1 10.73,15.01 arc45 10.79,14.86 11.71,13.95 13.02,13.95 arc-45 13.17,13.88 13.59,13.46 13.59,12.16 arc45 U$1.19
RF_P
  Top 0.254: L3.1 arc-45 9.88,2.14 C2.1 11.04,4.75 arc45 11.1,4.9 U$1.1
VBATT
  Top 0.254: C55.1 arc45 13.21,35.98 U4.3 arc-45 13.26,34.43 U6.1 arc-45 U6.1 16.1,33.5 arc45 16.1,33.5 U6.3 arc-45 16.15,32.41 16.15,30.93 arc-45 16.09,30.78 C56.2
VCC/2  (via drill 0.61)  (9 unrouted)
  Top 0.203: DIG_POT.12 DIG_POT.11
  Top 0.254: v69.11,23.88 69.97,23.02 arc45 70.11,22.96 C51.2 71.31,22.62 arc45 71.45,22.56 | 51.6,33.38 R13.2 52.68,37.04 arc45 52.82,37.1 R16.2 56.28,40.55 arc-45 56.42,40.62 C35.2 | 51.6,33.38 51.6,31.26 arc-45 51.61,31.23 51.61,30.43 51.04,29.85 arc-45 50.89,29.79 50.57,29.79 | 51.6,33.38 51.57,33.41 arc45 51.42,33.47 C39.2 arc-45 49.27,33.53 C40.2 | v65.05,21.95 arc-45 65.09,21.93 IC2.5 68.45,18.57 arc45 68.59,18.51 IC2.2 IC2.1 arc-45 71.32,17.2 C44.1 79.5,15.37 arc45 79.64,15.43 C47.+ | v64.91,23.94 64.01,24.84 R10.2 | 47.52,29.79 50.57,29.79 | C30.2 50.54,29.72 arc-45 50.57,29.79
  Bottom 0.254: v69.11,23.88 65.06,23.88 | 65.06,23.88 arc-45 v64.91,23.94 | 65.06,23.88 65.06,21.96 arc-45 v65.05,21.95
VCC/2_UNBUFF  (2 unrouted)
  Top 0.254: 74.18,19.33 arc-45 C48.1 arc-45 74.18,19.3 72.57,19.3 72.15,19.72 arc45 72.01,19.78 IC2.3
VOUT  (1 unrouted)
  Top 0.254: U6.5 18.83,34.43 arc-45 18.97,34.37 19.61,33.73 19.61,30.21 arc45 C57.1
X32K_Q1
  Top 0.203: U$1.4 12.6,6.17 12.93,5.84 12.93,5.44 13.64,4.72 13.64,3.96 C8.1 13.66,3.7 Q2.1 14.98,2.21
X32K_Q2
  Top 0.203: U$1.5 13.1,6.3 13.44,5.97 13.44,5.62 Q2.2 16.61,3.91 C9.1